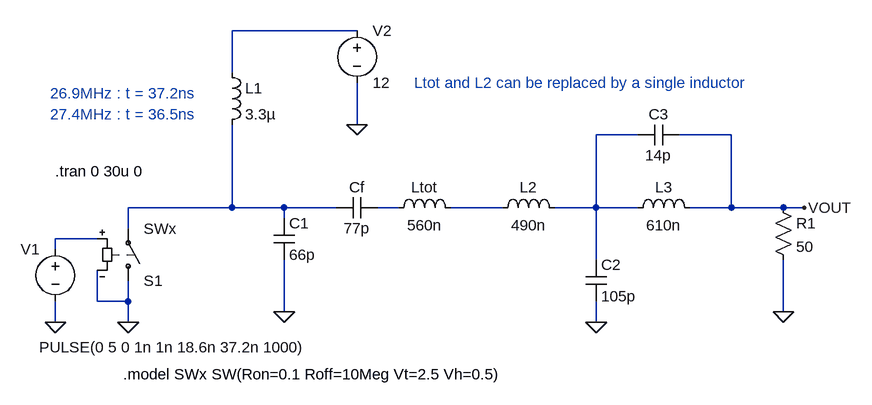
[diagram p0: schematic KD9PDP_TmatchNotch.asc]
KD9PDP_TmatchNotch.asc, the LTspice schematic file:
Version 4
SHEET 1 1900 680
WIRE 464 -144 272 -144
WIRE 272 -80 272 -144
WIRE 464 0 464 -64
WIRE 896 16 832 16
WIRE 1040 16 960 16
WIRE 272 128 272 0
WIRE 272 128 112 128
WIRE 352 128 272 128
WIRE 432 128 352 128
WIRE 528 128 496 128
WIRE 688 128 608 128
WIRE 832 128 832 16
WIRE 832 128 768 128
WIRE 896 128 832 128
WIRE 1040 128 1040 16
WIRE 1040 128 976 128
WIRE 1120 128 1040 128
WIRE 1152 128 1120 128
WIRE 352 144 352 128
WIRE 112 160 112 128
WIRE 64 176 0 176
WIRE 0 192 0 176
WIRE 832 208 832 128
WIRE 64 272 64 224
WIRE 112 272 112 240
WIRE 112 272 64 272
WIRE 352 288 352 208
WIRE 1120 288 1120 208
WIRE 0 304 0 272
WIRE 112 304 112 272
WIRE 832 304 832 272
FLAG 0 304 0
FLAG 464 0 0
FLAG 112 304 0
FLAG 352 288 0
FLAG 1152 128 VOUT
FLAG 1120 288 0
FLAG 832 304 0
SYMBOL voltage 0 176 M0
WINDOW 123 0 0 Left 0
WINDOW 39 0 0 Left 0
WINDOW 3 -387 167 Left 2
SYMATTR Value PULSE(0 5 0 1n 1n 18.6n 37.2n 1000)
SYMATTR InstName V1
SYMBOL voltage 464 -160 R0
WINDOW 123 0 0 Left 0
WINDOW 39 0 0 Left 0
SYMATTR InstName V2
SYMATTR Value 12
SYMBOL cap 336 144 R0
SYMATTR InstName C1
SYMATTR Value 66p
SYMBOL ind 256 -96 R0
SYMATTR InstName L1
SYMATTR Value 3.3µ
SYMBOL cap 496 112 R90
WINDOW 0 0 32 VBottom 2
WINDOW 3 32 32 VTop 2
SYMATTR InstName Cf
SYMATTR Value 77p
SYMBOL ind 512 144 R270
WINDOW 0 32 56 VTop 2
WINDOW 3 5 56 VBottom 2
SYMATTR InstName Ltot
SYMATTR Value 560n
SYMBOL sw 112 256 M180
SYMATTR InstName S1
SYMATTR Value SWx
SYMBOL res 1104 112 R0
SYMATTR InstName R1
SYMATTR Value 50
SYMBOL ind 672 144 R270
WINDOW 0 32 56 VTop 2
WINDOW 3 5 56 VBottom 2
SYMATTR InstName L2
SYMATTR Value 490n
SYMBOL ind 880 144 R270
WINDOW 0 32 56 VTop 2
WINDOW 3 5 56 VBottom 2
SYMATTR InstName L3
SYMATTR Value 610n
SYMBOL cap 816 208 R0
SYMATTR InstName C2
SYMATTR Value 105p
SYMBOL cap 960 0 R90
WINDOW 0 0 32 VBottom 2
WINDOW 3 32 32 VTop 2
SYMATTR InstName C3
SYMATTR Value 14p
TEXT 0 72 Left 2 !.tran 0 30u 0
TEXT 104 384 Left 2 !.model SWx SW(Ron=0.1 Roff=10Meg Vt=2.5 Vh=0.5)
TEXT -8 -48 Left 2 ;26.9MHz : t = 37.2ns
TEXT -8 -16 Left 2 ;27.4MHz : t = 36.5ns
TEXT 552 -64 Left 2 ;Ltot and L2 can be replaced by a single inductor

The netlist it stands for:
* KD9PDP_TmatchNotch.asc
V1 N006 0 PULSE(0 5 0 1n 1n 18.6n 37.2n 1000)
V2 N001 0 12
C1 N003 0 66p
L1 N001 N003 3.3µ
Cf N004 N003 77p
Ltot N004 N005 560n
S1 0 N003 N006 0 SWx
R1 VOUT 0 50
L2 N005 N002 490n
L3 N002 VOUT 610n
C2 N002 0 105p
C3 VOUT N002 14p
.tran 0 30u 0
.model SWx SW(Ron=0.1 Roff=10Meg Vt=2.5 Vh=0.5)
* 26.9MHz : t = 37.2ns
* 27.4MHz : t = 36.5ns
* Ltot and L2 can be replaced by a single inductor
.backanno
.end